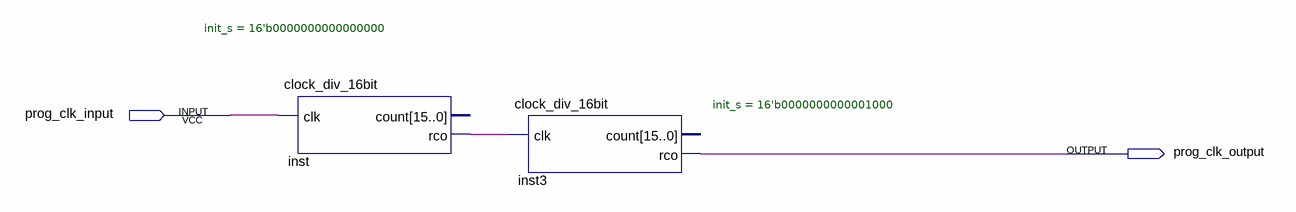
[diagram p0: schematic sheet]
// Quartus schematic progressive_clk_handler.bdf as structural Verilog: 2 symbols, 2 pins
module progressive_clk_handler (
  input  prog_clk_input,
  output prog_clk_output
);

  wire inst_rco;

  clock_div_16bit #(.init_s(16'b0000000000000000)) inst (.clk(prog_clk_input), .rco(inst_rco));  // open: count
  clock_div_16bit #(.init_s(16'b0000000000001000)) inst3 (.clk(inst_rco), .rco(prog_clk_output));  // open: count
endmodule
